# Altium schematic sheet Master.SchDoc
size A4; Organization: Altium Limited; Address1: L3, 12a Rodborough Rd; Address2: Frenchs Forest; Address3: NSW; Address4: Australia 2086; DocumentNumber: 1; SheetNumber: 1; SheetTotal: 8
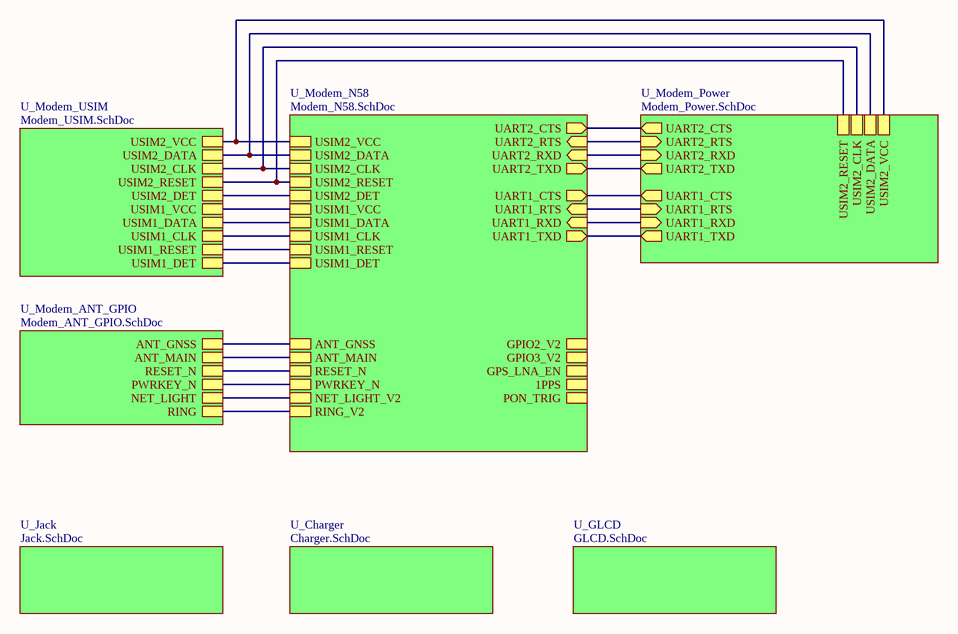
[diagram p0: Master.SchDoc]

## Sub-sheets
U_Charger = Charger.SchDoc: no entries
U_GLCD = GLCD.SchDoc: no entries
U_Jack = Jack.SchDoc: no entries
U_Modem_ANT_GPIO = Modem_ANT_GPIO.SchDoc: ANT_GNSS, ANT_MAIN, RESET_N, PWRKEY_N, NET_LIGHT, RING
U_Modem_N58 = Modem_N58.SchDoc: RING_V2, USIM2_VCC, USIM2_DATA, USIM2_CLK, USIM2_RESET, USIM2_DET, USIM1_VCC, USIM1_DATA, USIM1_CLK, USIM1_RESET, USIM1_DET, RESET_N, PWRKEY_N, PON_TRIG, UART2_RTS (in), UART2_CTS (out), UART2_RXD (in), UART2_TXD (out), GPIO2_V2, GPIO3_V2, ANT_MAIN, GPS_LNA_EN, 1PPS, ANT_GNSS, NET_LIGHT_V2, UART1_RTS (in), UART1_CTS (out), UART1_RXD (in), UART1_TXD (out)
U_Modem_Power = Modem_Power.SchDoc: UART2_RTS (in), UART2_TXD (out), UART2_RXD (in), UART2_CTS (out), UART1_RTS (in), UART1_TXD (out), UART1_RXD (in), UART1_CTS (out), USIM2_VCC, USIM2_DATA, USIM2_CLK, USIM2_RESET
U_Modem_USIM = Modem_USIM.SchDoc: USIM1_VCC, USIM1_DET, USIM1_DATA, USIM1_CLK, USIM1_RESET, USIM2_VCC, USIM2_DET, USIM2_DATA, USIM2_CLK, USIM2_RESET

## Nets
(unnamed): sheet U_Modem_Power/UART2_RTS, sheet U_Modem_N58/UART2_RTS
(unnamed): sheet U_Modem_Power/UART2_TXD, sheet U_Modem_N58/UART2_TXD
(unnamed): sheet U_Modem_Power/UART2_RXD, sheet U_Modem_N58/UART2_RXD
(unnamed): sheet U_Modem_Power/UART2_CTS, sheet U_Modem_N58/UART2_CTS
(unnamed): sheet U_Modem_Power/UART1_RTS, sheet U_Modem_N58/UART1_RTS
(unnamed): sheet U_Modem_Power/UART1_TXD, sheet U_Modem_N58/UART1_TXD
(unnamed): sheet U_Modem_Power/UART1_RXD, sheet U_Modem_N58/UART1_RXD
(unnamed): sheet U_Modem_Power/UART1_CTS, sheet U_Modem_N58/UART1_CTS
(unnamed): sheet U_Modem_Power/USIM2_VCC, sheet U_Modem_N58/USIM2_VCC, sheet U_Modem_USIM/USIM2_VCC
(unnamed): sheet U_Modem_Power/USIM2_DATA, sheet U_Modem_N58/USIM2_DATA, sheet U_Modem_USIM/USIM2_DATA
(unnamed): sheet U_Modem_Power/USIM2_CLK, sheet U_Modem_N58/USIM2_CLK, sheet U_Modem_USIM/USIM2_CLK
(unnamed): sheet U_Modem_Power/USIM2_RESET, sheet U_Modem_N58/USIM2_RESET, sheet U_Modem_USIM/USIM2_RESET
(unnamed): sheet U_Modem_N58/RING_V2, sheet U_Modem_ANT_GPIO/RING
(unnamed): sheet U_Modem_N58/USIM2_DET, sheet U_Modem_USIM/USIM2_DET
(unnamed): sheet U_Modem_N58/USIM1_VCC, sheet U_Modem_USIM/USIM1_VCC
(unnamed): sheet U_Modem_N58/USIM1_DATA, sheet U_Modem_USIM/USIM1_DATA
(unnamed): sheet U_Modem_N58/USIM1_CLK, sheet U_Modem_USIM/USIM1_CLK
(unnamed): sheet U_Modem_N58/USIM1_RESET, sheet U_Modem_USIM/USIM1_RESET
(unnamed): sheet U_Modem_N58/USIM1_DET, sheet U_Modem_USIM/USIM1_DET
(unnamed): sheet U_Modem_N58/RESET_N, sheet U_Modem_ANT_GPIO/RESET_N
(unnamed): sheet U_Modem_N58/PWRKEY_N, sheet U_Modem_ANT_GPIO/PWRKEY_N
(unnamed): sheet U_Modem_N58/ANT_MAIN, sheet U_Modem_ANT_GPIO/ANT_MAIN
(unnamed): sheet U_Modem_N58/ANT_GNSS, sheet U_Modem_ANT_GPIO/ANT_GNSS
(unnamed): sheet U_Modem_N58/NET_LIGHT_V2, sheet U_Modem_ANT_GPIO/NET_LIGHT

## Notes on the sheet
- Title
- Size:
- Date:
- MiniDatalogger
- A4
- Time:
- Drawn by:
- Bach
- Revision:
- Sheet
- of
- Sonrad
- 385 Tran Dai Nghia
- Hai Ba Trung
- Ha Noi
- Viet Nam
- File: